# Altium project DIO_SMA.PrjPCB (part 1 of 2)
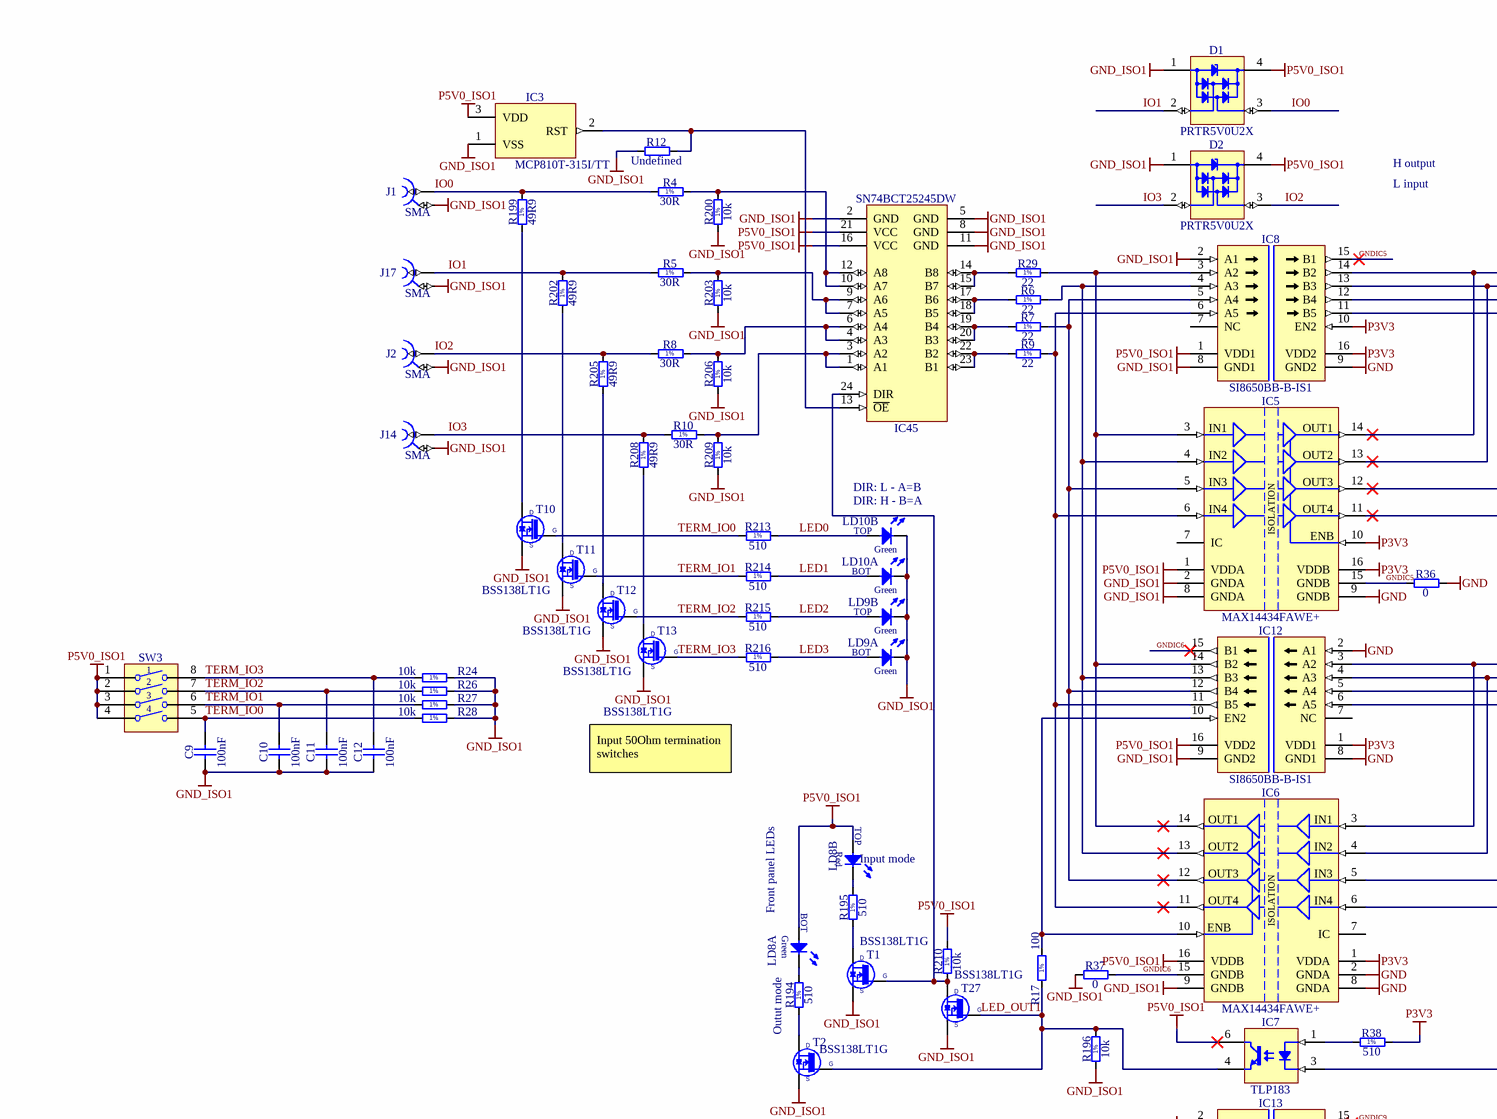
[diagram p0: DIO-SMA.schdoc, top left]
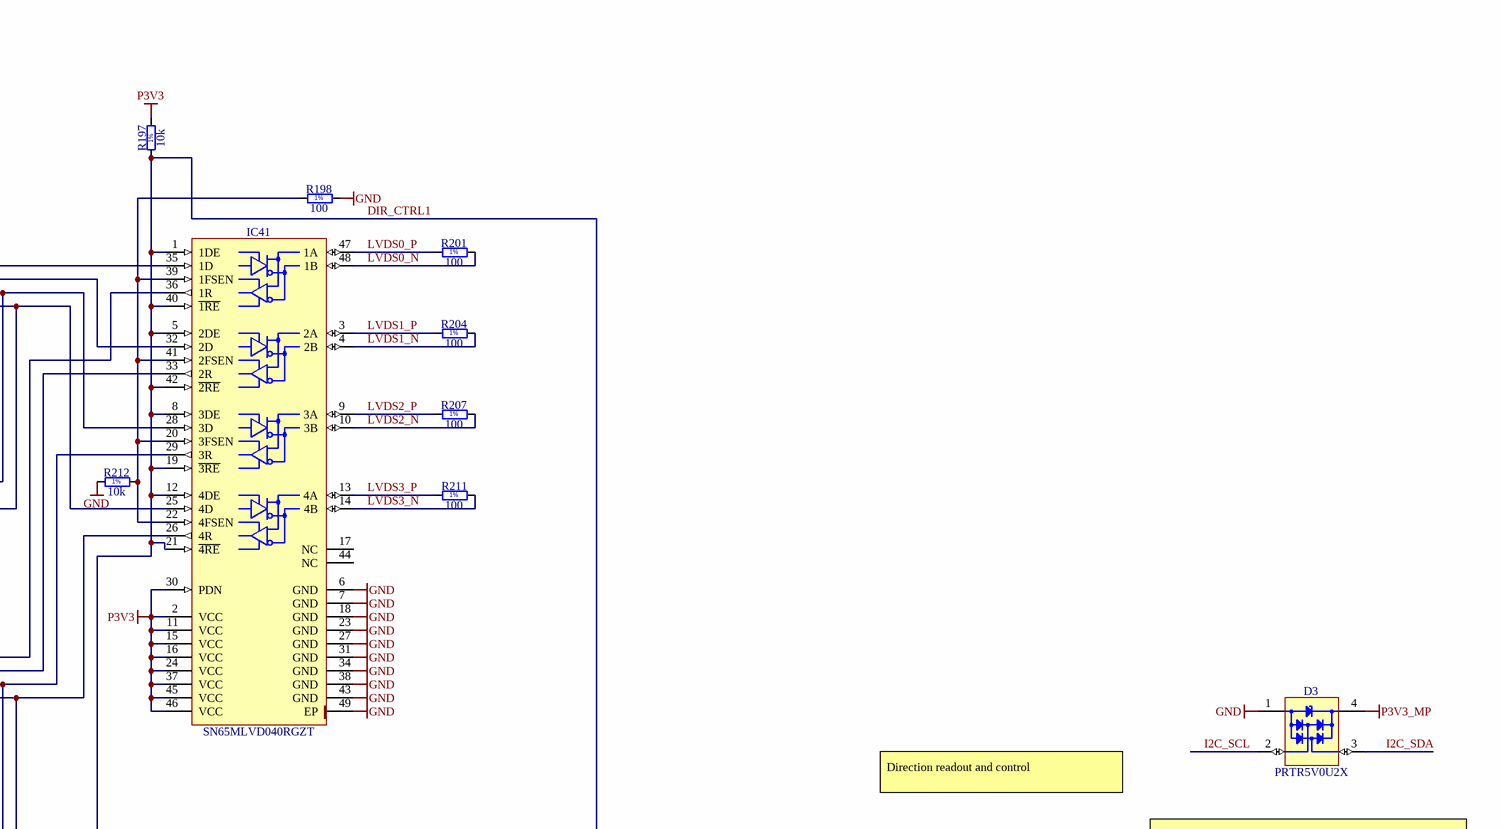
[diagram p1: DIO-SMA.schdoc, top right]
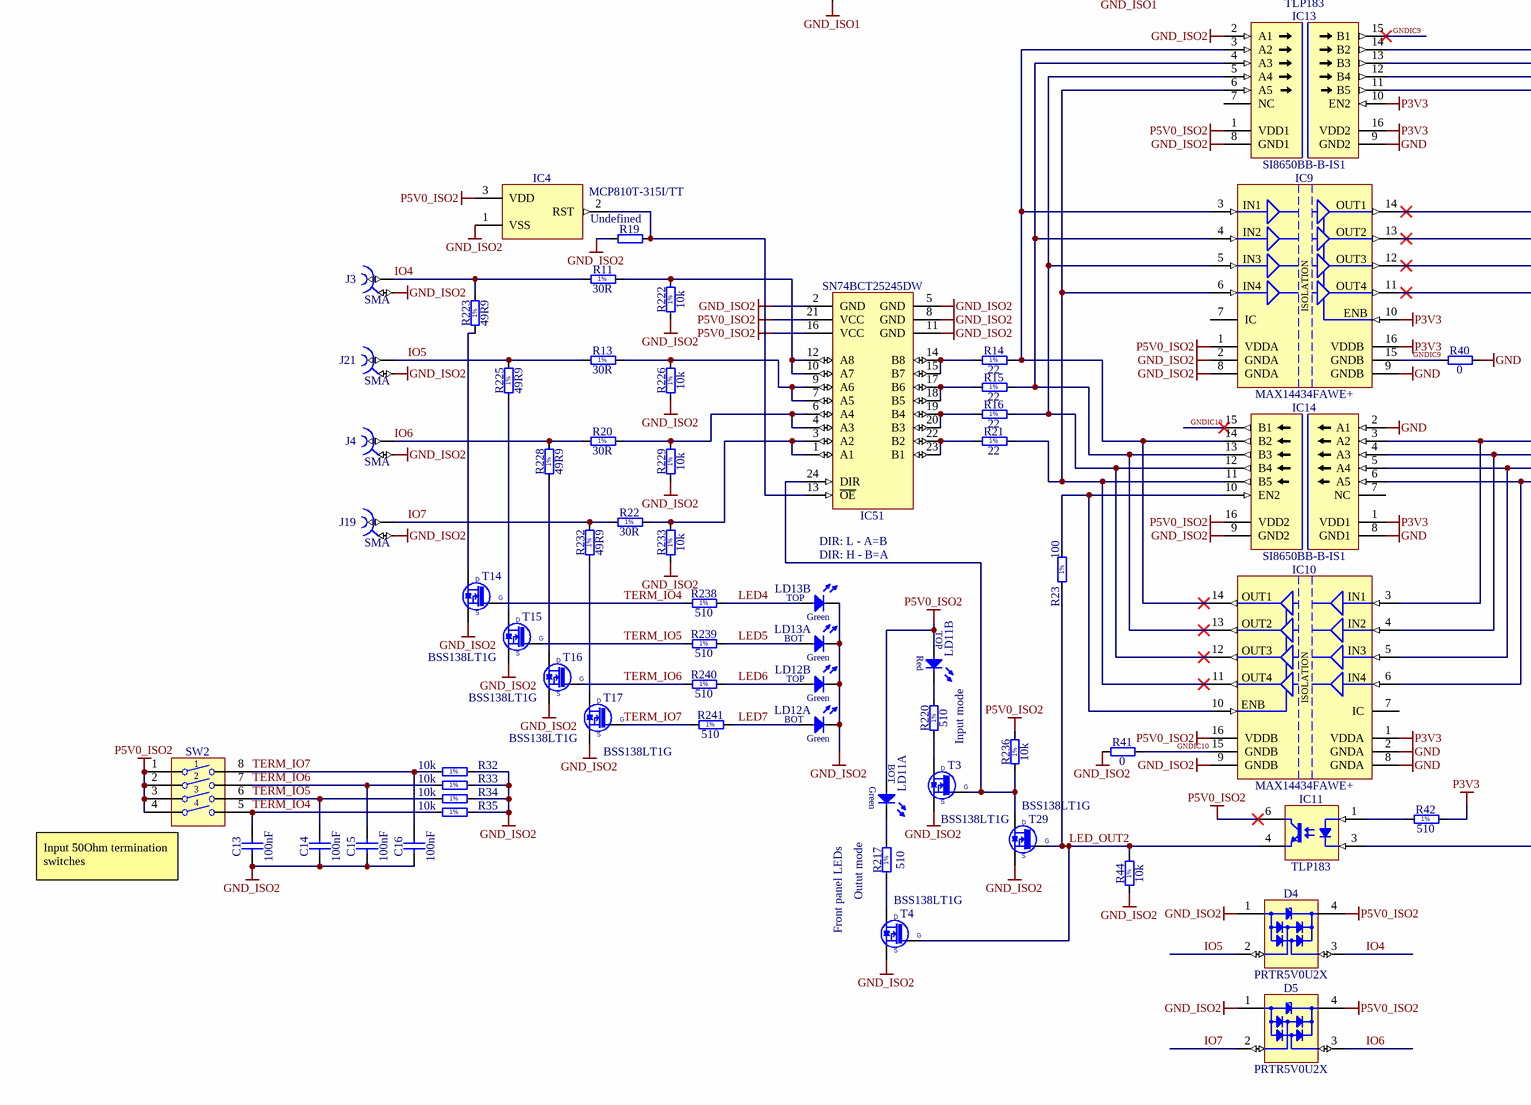
[diagram p2: DIO-SMA.schdoc, bottom left]
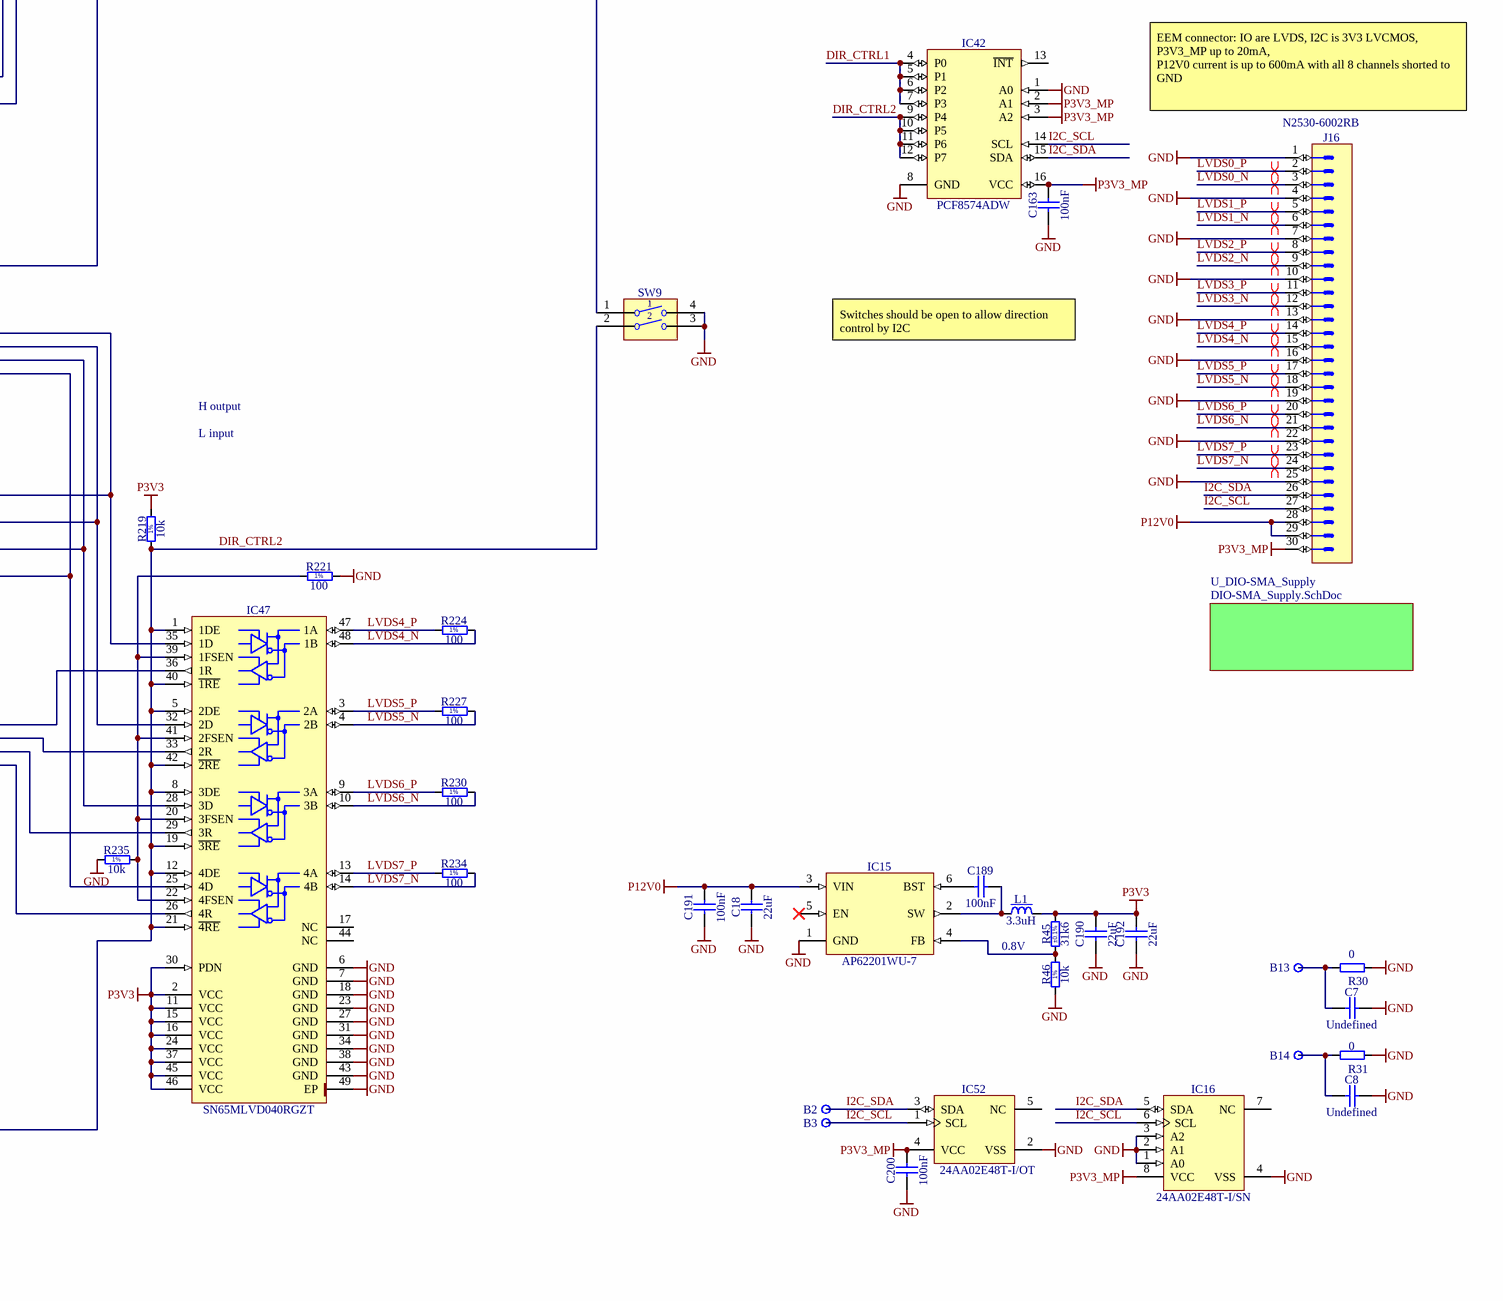
[diagram p3: DIO-SMA.schdoc, bottom right]
P_version: 1.4.3
2 sheets, 236 parts. Net scope: global (net labels, ports and power ports of the same name join across sheets).
Board file: DIO-SMA.PCBDOC
Sheets:
  DIO-SMA.schdoc
    U_DIO-SMA_Supply = DIO-SMA_Supply.SchDoc

## Sheet DIO-SMA.schdoc: DIO-SMA
size 594 x 420 mm; Author: G.K.; CompanyName: WUT; DrawnBy: G.K.; Organization: WUT ISE; Address1: Warsaw Univeristy of Technology; Address2: Nowowiejska 15/19; DocumentNumber: 1; Revision: 1.4.3; SheetNumber: 1; SheetTotal: 2; EDA_Number: ARTIQ; Projet: KASLI 3U subsystem; ModifiedBy: -; CreateDate: XX/XX/XXXX; CheckedDate: -; Title2: v1.4.3; DivGrp: ISE; Designer: G.K.; ModifiedDate: -; ProjectName: KASLI 3U subsystem

### Parts
B2  Plated Hole  [c130h60]  (value not drawn)  (no BOM)
B3  Plated Hole  [c130h60]  (value not drawn)  (no BOM)
B13  Plated Hole  [MTG270_500]  (value not drawn)  (no BOM)
B14  Plated Hole  [MTG270_500]  (value not drawn)  (no BOM)
C7  Undefined  [CAPC2012X135N]
C8  Undefined  [CAPC2012X135N]
C9  100nF  [CAPC1005X55N]
C10  100nF  [CAPC1005X55N]
C11  100nF  [CAPC1005X55N]
C12  100nF  [CAPC1005X55N]
C13  100nF  [CAPC1005X55N]
C14  100nF  [CAPC1005X55N]
C15  100nF  [CAPC1005X55N]
C16  100nF  [CAPC1005X55N]
C18  22uF  [CAPC2012X135N]
C163  100nF  [CAPC1005X55N]
C189  100nF  [CAPC1005X55N]
C190  22uF  [CAPC2012X135N]
C191  100nF  [CAPC1005X55N]
C192  22uF  [CAPC2012X135N]
C200  100nF  [CAPC1005X55N]
D1  PRTR5V0U2X  [SOT190P230X110-4N]
D2  PRTR5V0U2X  [SOT190P230X110-4N]
D3  PRTR5V0U2X  [SOT190P230X110-4N]
D4  PRTR5V0U2X  [SOT190P230X110-4N]
D5  PRTR5V0U2X  [SOT190P230X110-4N]
IC3  MCP810T-315I/TT  [SOT95P237X112-3N]
IC4  MCP810T-315I/TT  [SOT95P237X112-3N]
IC5  MAX14434FAWE+  [SOIC127P1030X265-16N]
IC6  MAX14434FAWE+  [SOIC127P1030X265-16N]
IC7  TLP183  [TOSHIBA_11-4M1S]
IC8  SI8650BB-B-IS1  [SOIC127P600X175-16N]
IC9  MAX14434FAWE+  [SOIC127P1030X265-16N]
IC10  MAX14434FAWE+  [SOIC127P1030X265-16N]
IC11  TLP183  [TOSHIBA_11-4M1S]
IC12  SI8650BB-B-IS1  [SOIC127P600X175-16N]
IC13  SI8650BB-B-IS1  [SOIC127P600X175-16N]
IC14  SI8650BB-B-IS1  [SOIC127P600X175-16N]
IC15  AP62201WU-7  [SOT95P280X100-6N]
IC16  24AA02E48T-I/SN  [SOIC127P600X175-8N]
IC41  SN65MLVD040RGZT  [QFN50P700X700X100-49N-S420]
IC42  PCF8574ADW  [SOIC127P1030X265-16N]
IC45  SN74BCT25245DW  [SOIC127P1030X265-24N]
IC47  SN65MLVD040RGZT  [QFN50P700X700X100-49N-S420]
IC51  SN74BCT25245DW  [SOIC127P1030X265-24N]
IC52  24AA02E48T-I/OT  [SOT95P280X145-5N]
J1  SMA  [DELOCK_65848]
J2  SMA  [DELOCK_65848]
J3  SMA  [DELOCK_65848]
J4  SMA  [DELOCK_65848]
J14  SMA  [MOLEX_73251-2120]
J16  Manufacturer Part Number: N2530-6002RB  [3M_N2530-6002RB]
J17  SMA  [MOLEX_73251-2120]
J19  SMA  [MOLEX_73251-2120]
J21  SMA  [MOLEX_73251-2120]
L1  3.3uH  [IND_WURTH_WE-TPC_4828]
LD8  Red/Green  [LED_DIALIGHT_571-0112F]  (value not drawn)  (parts A,B of 2)
LD9  Green/Green  [LED_DIALIGHT_571-0122F]  (value not drawn)  (parts A,B of 2)
LD10  Green/Green  [LED_DIALIGHT_571-0122F]  (value not drawn)  (parts A,B of 2)
LD11  Red/Green  [LED_DIALIGHT_571-0112F]  (value not drawn)  (parts A,B of 2)
LD12  Green/Green  [LED_DIALIGHT_571-0122F]  (value not drawn)  (parts A,B of 2)
LD13  Green/Green  [LED_DIALIGHT_571-0122F]  (value not drawn)  (parts A,B of 2)
R4  30R  [RESC3225X70N]
R5  30R  [RESC3225X70N]
R6  22  [RESC1005X40N]
R7  22  [RESC1005X40N]
R8  30R  [RESC3225X70N]
R9  22  [RESC1005X40N]
R10  30R  [RESC3225X70N]
R11  30R  [RESC3225X70N]
R12  Undefined  [RESC1005X40N]
R13  30R  [RESC3225X70N]
R14  22  [RESC1005X40N]
R15  22  [RESC1005X40N]
R16  22  [RESC1005X40N]
R17  100  [RESC1005X40N]
R19  Undefined  [RESC1005X40N]
R20  30R  [RESC3225X70N]
R21  22  [RESC1005X40N]
R22  30R  [RESC3225X70N]
R23  100  [RESC1005X40N]
R24  10k  [RESC1005X40N]
R26  10k  [RESC1005X40N]
R27  10k  [RESC1005X40N]
R28  10k  [RESC1005X40N]
R29  22  [RESC1005X40N]
R30  0  [RESC1608X55N]
R31  0  [RESC1608X55N]
R32  10k  [RESC1005X40N]
R33  10k  [RESC1005X40N]
R34  10k  [RESC1005X40N]
R35  10k  [RESC1005X40N]
R36  0  [RESC1005X40N]
R37  0  [RESC1005X40N]
R38  510  [RESC1005X40N]
R40  0  [RESC1005X40N]
R41  0  [RESC1005X40N]
R42  510  [RESC1005X40N]
R44  10k  [RESC1005X40N]
R45  31k6  Tolerance: ±0.1%  [RESC1005X35N]
R46  10k  [RESC1005X40N]
R194  510  [RESC1005X40N]
R195  510  [RESC1005X40N]
R196  10k  [RESC1005X40N]
R197  10k  [RESC1005X40N]
R198  100  [RESC1005X40N]
R199  49R9  [RESC3225X70N]
R200  10k  [RESC1005X40N]
R201  100  [RESC1005X40N]
R202  49R9  [RESC3225X70N]
R203  10k  [RESC1005X40N]
R204  100  [RESC1005X40N]
R205  49R9  [RESC3225X70N]
R206  10k  [RESC1005X40N]
R207  100  [RESC1005X40N]
R208  49R9  [RESC3225X70N]
R209  10k  [RESC1005X40N]
R210  10k  [RESC1005X40N]
R211  100  [RESC1005X40N]
R212  10k  [RESC1005X40N]
R213  510  [RESC1005X40N]
R214  510  [RESC1005X40N]
R215  510  [RESC1005X40N]
R216  510  [RESC1005X40N]
R217  510  [RESC1005X40N]
R219  10k  [RESC1005X40N]
R220  510  [RESC1005X40N]
R221  100  [RESC1005X40N]
R222  10k  [RESC1005X40N]
R223  49R9  [RESC3225X70N]
R224  100  [RESC1005X40N]
R225  49R9  [RESC3225X70N]
R226  10k  [RESC1005X40N]
R227  100  [RESC1005X40N]
R228  49R9  [RESC3225X70N]
R229  10k  [RESC1005X40N]
R230  100  [RESC1005X40N]
R232  49R9  [RESC3225X70N]
R233  10k  [RESC1005X40N]
R234  100  [RESC1005X40N]
R235  10k  [RESC1005X40N]
R236  10k  [RESC1005X40N]
R238  510  [RESC1005X40N]
R239  510  [RESC1005X40N]
R240  510  [RESC1005X40N]
R241  510  [RESC1005X40N]
SW2  Switch  [SW_OMRON_A6S-4102-H]  (value not drawn)
SW3  Switch  [SW_OMRON_A6S-4102-H]  (value not drawn)
SW9  Switch  [SW_OMRON_A6S-2102-H]  (value not drawn)
T1  BSS138LT1G  [SOT95P240X110-3N]
T2  BSS138LT1G  [SOT95P240X110-3N]
T3  BSS138LT1G  [SOT95P240X110-3N]
T4  BSS138LT1G  [SOT95P240X110-3N]
T10  BSS138LT1G  [SOT95P240X110-3N]
T11  BSS138LT1G  [SOT95P240X110-3N]
T12  BSS138LT1G  [SOT95P240X110-3N]
T13  BSS138LT1G  [SOT95P240X110-3N]
T14  BSS138LT1G  [SOT95P240X110-3N]
T15  BSS138LT1G  [SOT95P240X110-3N]
T16  BSS138LT1G  [SOT95P240X110-3N]
T17  BSS138LT1G  [SOT95P240X110-3N]
T27  BSS138LT1G  [SOT95P240X110-3N]
T29  BSS138LT1G  [SOT95P240X110-3N]

### Sub-sheets
U_DIO-SMA_Supply = DIO-SMA_Supply.SchDoc: no entries

### Nets
GND: C7.2 C8.2 C18.1 C163.1 C190.1 C191.1 C192.1 C200.1 D3.1(GND) IC5.9(GNDB) IC6.2(GNDA) IC6.8(GNDA) IC8.9(GND2) IC9.9(GNDB) IC10.2(GNDA) IC10.8(GNDA) IC12.2(A1) IC12.8(GND1) IC13.9(GND2) IC14.2(A1) IC14.8(GND1) IC15.1(GND) IC16.1(A0) IC16.2(A1) IC16.3(A2) IC16.4(VSS) IC41.6(GND) IC41.7(GND) IC41.18(GND) IC41.23(GND) IC41.27(GND) IC41.31(GND) IC41.34(GND) IC41.38(GND) IC41.43(GND) IC41.49(EP) IC42.1(A0) IC42.8(GND) IC47.6(GND) IC47.7(GND) IC47.18(GND) IC47.23(GND) IC47.27(GND) IC47.31(GND) IC47.34(GND) IC47.38(GND) IC47.43(GND) IC47.49(EP) IC52.2(VSS) J16.1 J16.4 J16.7 J16.10 J16.13 J16.16 J16.19 J16.22 J16.25 R30.1 R31.1 R36.2 R40.2 R46.1 R198.2 R212.2 R221.2 R235.2 SW9.3 SW9.4
GND_ISO1: C9.1 C10.1 C11.1 C12.1 D1.1(GND) D2.1(GND) IC3.1(VSS) IC5.2(GNDA) IC5.8(GNDA) IC6.9(GNDB) IC8.2(A1) IC8.8(GND1) IC12.9(GND2) IC45.2(GND) IC45.5(GND) IC45.8(GND) IC45.11(GND) J1.2 J2.2 J14.2 J17.2 LD9.1(C) LD9.3(C) LD10.1(C) LD10.3(C) R12.1 R24.2 R26.2 R27.2 R28.2 R37.1 R196.1 R200.1 R203.1 R206.1 R209.1 T1.2(S) T2.2(S) T10.2(S) T11.2(S) T12.2(S) T13.2(S) T27.2(S)
GND_ISO2: C13.1 C14.1 C15.1 C16.1 D4.1(GND) D5.1(GND) IC4.1(VSS) IC9.2(GNDA) IC9.8(GNDA) IC10.9(GNDB) IC13.2(A1) IC13.8(GND1) IC14.9(GND2) IC51.2(GND) IC51.5(GND) IC51.8(GND) IC51.11(GND) J3.2 J4.2 J19.2 J21.2 LD12.1(C) LD12.3(C) LD13.1(C) LD13.3(C) R19.1 R32.2 R33.2 R34.2 R35.2 R41.1 R44.1 R222.1 R226.1 R229.1 R233.1 T3.2(S) T4.2(S) T14.2(S) T15.2(S) T16.2(S) T17.2(S) T29.2(S)
P3V3: C190.2 C192.2 IC5.10(ENB) IC5.16(VDDB) IC6.1(VDDA) IC8.10(EN2) IC8.16(VDD2) IC9.10(ENB) IC9.16(VDDB) IC10.1(VDDA) IC12.1(VDD1) IC13.10(EN2) IC13.16(VDD2) IC14.1(VDD1) IC41.2(VCC) IC41.11(VCC) IC41.15(VCC) IC41.16(VCC) IC41.24(VCC) IC41.30(PDN) IC41.37(VCC) IC41.45(VCC) IC41.46(VCC) IC47.2(VCC) IC47.11(VCC) IC47.15(VCC) IC47.16(VCC) IC47.24(VCC) IC47.30(PDN) IC47.37(VCC) IC47.45(VCC) IC47.46(VCC) L1.2 R38.2 R42.2 R45.2 R197.2 R219.2
P3V3_MP: C163.2 C200.2 D3.4(VCC) IC16.8(VCC) IC42.2(A1) IC42.3(A2) IC42.16(VCC) IC52.4(VCC) J16.30
P5V0_ISO1: D1.4(VCC) D2.4(VCC) IC3.3(VDD) IC5.1(VDDA) IC6.16(VDDB) IC7.6(C) IC8.1(VDD1) IC12.16(VDD2) IC45.16(VCC) IC45.21(VCC) LD8.2(A) LD8.4(A) R210.2 SW3.1 SW3.2 SW3.3 SW3.4
P5V0_ISO2: D4.4(VCC) D5.4(VCC) IC4.3(VDD) IC9.1(VDDA) IC10.16(VDDB) IC11.6(C) IC13.1(VDD1) IC14.16(VDD2) IC51.16(VCC) IC51.21(VCC) LD11.2(A) LD11.4(A) R236.2 SW2.1 SW2.2 SW2.3 SW2.4
P12V0: C18.2 C191.2 IC15.3(VIN) J16.28 J16.29
DIR_CTRL1: IC7.3(C) IC41.1(1DE) IC41.5(2DE) IC41.8(3DE) IC41.12(4DE) IC41.19(~{3RE}) IC41.21(~{4RE}) IC41.40(~{1RE}) IC41.42(~{2RE}) IC42.4(P0) IC42.5(P1) IC42.6(P2) IC42.7(P3) R197.1 SW9.1
DIR_CTRL2: IC11.3(C) IC42.9(P4) IC42.10(P5) IC42.11(P6) IC42.12(P7) IC47.1(1DE) IC47.5(2DE) IC47.8(3DE) IC47.12(4DE) IC47.19(~{3RE}) IC47.21(~{4RE}) IC47.40(~{1RE}) IC47.42(~{2RE}) R219.1 SW9.2
GNDIC5: IC5.15(GNDB) IC8.15(B1) R36.1
GNDIC6: IC6.15(GNDB) IC12.15(B1) R37.2
GNDIC9: IC9.15(GNDB) IC13.15(B1) R40.1
GNDIC10: IC10.15(GNDB) IC14.15(B1) R41.2
I2C_SCL: B3.1 D3.2(I/O1) IC16.6(SCL) IC42.14(SCL) IC52.1(SCL) J16.27
I2C_SDA: B2.1 D3.3(I/O2) IC16.5(SDA) IC42.15(SDA) IC52.3(SDA) J16.26
IO0: D1.3(I/O2) J1.1 R4.1 R199.2
IO1: D1.2(I/O1) J17.1 R5.1 R202.2
IO2: D2.3(I/O2) J2.1 R8.1 R205.2
IO3: D2.2(I/O1) J14.1 R10.1 R208.2
IO4: D4.3(I/O2) J3.1 R11.1 R223.2
IO5: D4.2(I/O1) J21.1 R13.1 R225.2
IO6: D5.3(I/O2) J4.1 R20.1 R228.2
IO7: D5.2(I/O1) J19.1 R22.1 R232.2
LED0: LD10.4(A) R213.2
LED1: LD10.2(A) R214.2
LED2: LD9.4(A) R215.2
LED3: LD9.2(A) R216.2
LED4: LD13.4(A) R238.2
LED5: LD13.2(A) R239.2
LED6: LD12.4(A) R240.2
LED7: LD12.2(A) R241.2
LED_OUT1: IC7.4(E) R17.1 R196.2 T2.1(G) T27.1(G)
LED_OUT2: IC11.4(E) R23.1 R44.2 T4.1(G) T29.1(G)
LVDS0_N: IC41.48(1B) J16.3 R201.2
LVDS0_P: IC41.47(1A) J16.2 R201.1
LVDS1_N: IC41.4(2B) J16.6 R204.2
LVDS1_P: IC41.3(2A) J16.5 R204.1
LVDS2_N: IC41.10(3B) J16.9 R207.2
LVDS2_P: IC41.9(3A) J16.8 R207.1
LVDS3_N: IC41.14(4B) J16.12 R211.2
LVDS3_P: IC41.13(4A) J16.11 R211.1
LVDS4_N: IC47.48(1B) J16.15 R224.2
LVDS4_P: IC47.47(1A) J16.14 R224.1
LVDS5_N: IC47.4(2B) J16.18 R227.2
LVDS5_P: IC47.3(2A) J16.17 R227.1
LVDS6_N: IC47.10(3B) J16.21 R230.2
LVDS6_P: IC47.9(3A) J16.20 R230.1
LVDS7_N: IC47.14(4B) J16.24 R234.2
LVDS7_P: IC47.13(4A) J16.23 R234.1
TERM_IO0: C9.2 R28.1 R213.1 SW3.5 T10.1(G)
TERM_IO1: C10.2 R27.1 R214.1 SW3.6 T11.1(G)
TERM_IO2: C11.2 R26.1 R215.1 SW3.7 T12.1(G)
TERM_IO3: C12.2 R24.1 R216.1 SW3.8 T13.1(G)
TERM_IO4: C13.2 R35.1 R238.1 SW2.5 T14.1(G)
TERM_IO5: C14.2 R34.1 R239.1 SW2.6 T15.1(G)
TERM_IO6: C15.2 R33.1 R240.1 SW2.7 T16.1(G)
TERM_IO7: C16.2 R32.1 R241.1 SW2.8 T17.1(G)
NetB13_1: B13.1 C7.1 R30.2
NetB14_1: B14.1 C8.1 R31.2
NetC189_1: C189.1 IC15.6(BST)
NetC189_2: C189.2 IC15.2(SW) L1.1
NetIC3_2: IC3.2(RST) IC45.13(~{OE}) R12.2
NetIC4_2: IC4.2(RST) IC51.13(~{OE}) R19.2
NetIC5_3: IC5.3(IN1) IC6.14(OUT1) IC8.3(A2) IC12.14(B2) R29.2
NetIC5_4: IC5.4(IN2) IC6.13(OUT2) IC8.4(A3) IC12.13(B3) R6.2
NetIC5_5: IC5.5(IN3) IC6.12(OUT3) IC8.5(A4) IC12.12(B4) R7.2
NetIC5_6: IC5.6(IN4) IC6.11(OUT4) IC8.6(A5) IC12.11(B5) R9.2
NetIC5_11: IC5.11(OUT4) IC8.11(B5) IC41.25(4D)
NetIC5_12: IC5.12(OUT3) IC8.12(B4) IC41.28(3D)
NetIC5_13: IC5.13(OUT2) IC8.13(B3) IC41.32(2D)
NetIC5_14: IC5.14(OUT1) IC8.14(B2) IC41.35(1D)
NetIC6_3: IC6.3(IN1) IC12.3(A2) IC41.36(1R)
NetIC6_4: IC6.4(IN2) IC12.4(A3) IC41.33(2R)
NetIC6_5: IC6.5(IN3) IC12.5(A4) IC41.29(3R)
NetIC6_6: IC6.6(IN4) IC12.6(A5) IC41.26(4R)
NetIC6_10: IC6.10(ENB) IC12.10(EN2) R17.2
NetIC7_1: IC7.1(A) R38.1
NetIC9_3: IC9.3(IN1) IC10.14(OUT1) IC13.3(A2) IC14.14(B2) R14.2
NetIC9_4: IC9.4(IN2) IC10.13(OUT2) IC13.4(A3) IC14.13(B3) R15.2
NetIC9_5: IC9.5(IN3) IC10.12(OUT3) IC13.5(A4) IC14.12(B4) R16.2
NetIC9_6: IC9.6(IN4) IC10.11(OUT4) IC13.6(A5) IC14.11(B5) R21.2
NetIC9_11: IC9.11(OUT4) IC13.11(B5) IC47.25(4D)
NetIC9_12: IC9.12(OUT3) IC13.12(B4) IC47.28(3D)
NetIC9_13: IC9.13(OUT2) IC13.13(B3) IC47.32(2D)
NetIC9_14: IC9.14(OUT1) IC13.14(B2) IC47.35(1D)
NetIC10_3: IC10.3(IN1) IC14.3(A2) IC47.36(1R)
NetIC10_4: IC10.4(IN2) IC14.4(A3) IC47.33(2R)
NetIC10_5: IC10.5(IN3) IC14.5(A4) IC47.29(3R)
NetIC10_6: IC10.6(IN4) IC14.6(A5) IC47.26(4R)
NetIC10_10: IC10.10(ENB) IC14.10(EN2) R23.2
NetIC11_1: IC11.1(A) R42.1
NetIC15_4: IC15.4(FB) R45.1 R46.2
NetIC41_20: IC41.20(3FSEN) IC41.22(4FSEN) IC41.39(1FSEN) IC41.41(2FSEN) R198.1 R212.1
NetIC45_1: IC45.1(A1) IC45.3(A2) R10.2 R209.2
NetIC45_4: IC45.4(A3) IC45.6(A4) R8.2 R206.2
NetIC45_7: IC45.7(A5) IC45.9(A6) R5.2 R203.2
NetIC45_10: IC45.10(A7) IC45.12(A8) R4.2 R200.2
NetIC45_14: IC45.14(B8) IC45.15(B7) R29.1
NetIC45_17: IC45.17(B6) IC45.18(B5) R6.1
NetIC45_19: IC45.19(B4) IC45.20(B3) R7.1
NetIC45_22: IC45.22(B2) IC45.23(B1) R9.1
NetIC45_24: IC45.24(DIR) R210.1 T1.1(G) T27.3(D)
NetIC47_20: IC47.20(3FSEN) IC47.22(4FSEN) IC47.39(1FSEN) IC47.41(2FSEN) R221.1 R235.1
NetIC51_1: IC51.1(A1) IC51.3(A2) R22.2 R233.2
NetIC51_4: IC51.4(A3) IC51.6(A4) R20.2 R229.2
NetIC51_7: IC51.7(A5) IC51.9(A6) R13.2 R226.2
NetIC51_10: IC51.10(A7) IC51.12(A8) R11.2 R222.2
NetIC51_14: IC51.14(B8) IC51.15(B7) R14.1
NetIC51_17: IC51.17(B6) IC51.18(B5) R15.1
NetIC51_19: IC51.19(B4) IC51.20(B3) R16.1
NetIC51_22: IC51.22(B2) IC51.23(B1) R21.1
NetIC51_24: IC51.24(DIR) R236.1 T3.1(G) T29.3(D)
NetLD8_1: LD8.1(C) R194.2
NetLD8_3: LD8.3(C) R195.2
NetLD11_1: LD11.1(C) R217.2
NetLD11_3: LD11.3(C) R220.2
NetR194_1: R194.1 T2.3(D)
NetR195_1: R195.1 T1.3(D)
NetR199_1: R199.1 T10.3(D)
NetR202_1: R202.1 T11.3(D)
NetR205_1: R205.1 T12.3(D)
NetR208_1: R208.1 T13.3(D)
NetR217_1: R217.1 T4.3(D)
NetR220_1: R220.1 T3.3(D)
NetR223_1: R223.1 T14.3(D)
NetR225_1: R225.1 T15.3(D)
NetR228_1: R228.1 T16.3(D)
NetR232_1: R232.1 T17.3(D)

Not connected (* = marked no-connect by the designer): IC5 7(IC); IC6 7(IC); IC8 7(NC); IC9 7(IC); IC10 7(IC); IC12 7(NC); IC13 7(NC); IC14 7(NC); IC15 5(EN)*; IC16 7(NC); IC41 17(NC) 44(NC); IC42 13(~{INT}); IC47 17(NC) 44(NC); IC52 5(NC)

### Layout directives
differential pair: LVDS0_N, LVDS0_P, LVDS1_N, LVDS1_P, LVDS2_N, LVDS2_P, LVDS3_N, LVDS3_P, LVDS4_N, LVDS4_P, LVDS5_N, LVDS5_P, LVDS6_N, LVDS6_P, LVDS7_N, LVDS7_P

### Notes on the sheet
- H output
- L input
- (near LD10) DIR: L - A=B
- (near LD10) DIR: H - B=A
- Input 50Ohm termination switches
- Direction readout and control
- (near LD8) Input mode
- (near LD8) Front panel LEDs
- EEM connector: IO are LVDS, I2C is 3V3 LVCMOS, P3V3_MP up to 20mA,
  P12V0 current is up to 600mA with all 8 channels shorted to GND
- Outut mode
- Switches should be open to allow direction control by I2C
- DIR: L - A=B
- DIR: H - B=A
- 0.8V
- Input mode
- (near SW2) Input 50Ohm termination switches
- Front panel LEDs
- Project/Equipment
- Document
- File
- Designer
- Drawn by
- Check.by
- Last Mod.
- Copyright WUT ISE 2020.
  This documentation describes Open Hardware and is licensed under the CERN OHL v.1.2. You may redistribute and modify this documentation under the terms of the CERN OHL v.1.2. (http://ohwr.org/CERNOHL). This documentation is distributed WITHOUT ANY EXPRESS OR IMPLIED WARRANTY, INCLUDING OF MERCHANTABILITY, SATISFACTORY QUALITY AND FITNESS FOR A PARTICULAR PURPOSE. Please see the CERN OHL v.1.2 for applicable conditions.
- Contact
- Print Date
- Sheet
- Size
- A2
- of
- Rev
- (in symbol LED_DIALIGHT_571-0112F, part A) BOT; Green
- (in symbol LED_DIALIGHT_571-0112F, part B) TOP; Red
- (in symbol LED_DIALIGHT_571-0122F, part A) BOT; Green
- (in symbol LED_DIALIGHT_571-0122F, part B) TOP; Green
- (in symbol MAX14434FAWE+) ISOLATION
- (in symbol R0402_10K_1%_0.0625W_100PPM) 1%
- (in symbol R0402_22R_1%_0.0625W_100PPM) 1%
- (in symbol R0402_100R_1%_0.1W_100PPM) 1%
- (in symbol R0402_510R_1%_0.0625W_100PPM) 1%
- (in symbol R1210_30R_5%_0.5W_200PPM) 1%
- (in symbol R1210_49R9_1%_0.5W_100PPM_VISHAY_CRCW) 1%

### Library data of the parts
B2 B3 = PLATED_HOLE0.6_PAD1.3: Single Terminal Socket; Part Description: Plated Through Hole: Hole Dia.=0.6mm Pad Dia.=1.3mm; Mounted: No; Part Number: PLATED_HOLE0.6_PAD1.3; Component Type: Standard (No BOM); Pin Count: 1; Family: Plated Hole; Socket: No; SMD: No; Sense: No; Status: None; ComponentHeight: 0mm; HelpURL: Undefined; Author: CERN DEM MR; CreateDate: 02.03.2016; LatestRevisionDate: 02.03.2016; PackageDescription: Plated Through Hole: Hole Dia.=0.6mm Pad Dia.=1.3mm
B13 B14 = PLATED_HOLE2.7_PAD5.0: Single Terminal Socket; Part Description: Plated Through Hole: Hole Dia.=2.7mm Pad Dia.=5.0mm; Mounted: No; Part Number: PLATED_HOLE2.7_PAD5.0; Component Type: Standard (No BOM); Pin Count: 1; Family: Plated Hole; Socket: No; SMD: No; Sense: No; Status: None; ComponentHeight: 0mm; HelpURL: Undefined; Author: CERN DEM JMW; CreateDate: 27.09.2011; LatestRevisionDate: 27.09.2011; PackageDescription: Plated Through Hole: Hole Dia.=2.7mm Pad Dia.=5.0mm
C7 C8 = CC0805_NO-VALUE: Non-polarised capacitor; Part Description: Reserved Footprint For 0805(2012) Chip Ceramic Capacitor; Mounted: No; Part Number: CC0805_NO-VALUE; Component Kind: Standard; Component Type: Standard; Pin Count: 2; Value: Undefined; Status: None; Manufacturer: Undefined; Manufacturer Part Number: CC0805_NO-VALUE; Case: 0805; Socket: No; SMD: Yes; Sense: No; Manufacturer1 ComponentHeight: 1.35mm; HelpURL: Undefined; Author: CERN DEM JLC; CreateDate: 10.12.2008; LatestRevisionDate: 11.09.2013
C9-C16 C163 C189 C191 C200 = CC0402_100NF_16V_10%_X5R: Non-polarised capacitor; Part Description: SMD Multilayer Chip Ceramic Capacitor; Manufacturer: GENERIC; Manufacturer1 Part Number: GRM155R61C104KA88D; Voltage: 16V; TC: X5R; Tolerance: ±10%; Part Number: CC0402_100NF_16V_10%_X5R; Component Kind: Standard; Component Type: Standard; Pin Count: 2; Value: 100nF; Status: None; Manufacturer Part Number: CC0402_100NF_16V_10%_X5R; Case: 0402; Mounted: Yes; Socket: No; SMD: Yes; Sense: No; Manufacturer1 Example: MURATA; Manufacturer1 ComponentHeight: 0.55mm; HelpURL: \\cern.ch\dfs\Applications\Altium\Datasheets\CC0402_X5R_MURATA_GRM.pdf; Author: CERN DEM JLC; CreateDate: 10.12.2013; LatestRevisionDate: 10.12.2013
C18 C190 C192 = CC0805_22UF_16V_10%_X5R: Non-polarised capacitor; Part Description: SMD Multilayer Chip Ceramic Capacitor; Manufacturer: GENERIC; Manufacturer1 Part Number: C2012X5R1C226KT; Voltage: 16V; TC: X5R; Tolerance: ±10%; Part Number: CC0805_22UF_16V_10%_X5R; Component Kind: Standard; Component Type: Standard; Pin Count: 2; Value: 22uF; Status: Preferred; Manufacturer Part Number: CC0805_22UF_16V_10%_X5R; Case: 0805; Mounted: Yes; Socket: No; SMD: Yes; Sense: No; Manufacturer1 Example: TDK; Manufacturer1 ComponentHeight: 1.35mm; HelpURL: \\cern.ch\dfs\Applications\Altium\Datasheets\CC0805_X5R_TDK_C.pdf; Author: CERN DEM JLC; CreateDate: 25.10.2012; LatestRevisionDate: 25.10.2012
D1-D5 = PRTR5V0U2X: Ultra Low Capacitance Double Rail-to-Rail ESD Protection Diode; Part Description: Ultra Low Capacitance (1pF) Double Rail-to-Rail ESD Protection Diode (8kV); Manufacturer: NXP SEMICONDUCTORS; Voltage: 5.5V; PressFit: No; Bonding: No; Part Number: PRTR5V0U2X; Component Kind: Standard; Component Type: Standard; Device: PRTR5V0U2X; PackageDescription: SOT143B, SOT, 1.90mm Pitch; 4 Pin, 1.30mm W X 2.90mm L X 1.10mm H body, IPC Medium Density; Manufacturer Part Number: PRTR5V0U2X; Pin Count: 4; Case: SOT143B; Mounted: Yes; Socket: No; SMD: Yes; Sense: No; ComponentHeight: 1.1mm; HelpURL: \\cern.ch\dfs\Applications\Altium\Datasheets\PRTR5V0U2X.pdf; Author: CERN DEM JLC; CreateDate: 22.03.2011; LatestRevisionDate: 22.03.2011
IC3 IC4 = VMON_MCP810: 3.075V Microcontroller Supervisory Circuit With Push-Pull Output; Manufacturer: MICROCHIP TECHNOLOGY; PressFit: No; Bonding: No; Part Number: MCP810T-315I/TT; Component Kind: Standard; Component Type: Standard; Device: MCP810T-315I/TT; PackageDescription: SOT, 0.95mm, pitch; 3 pin,1.30mm W X 2.92mm L X 1.12mm H body, IPC Medium Density; Part Description: 3.075V Microcontroller Supervisory Circuit With Push-Pull Output; Manufacturer Part Number: MCP810T-315I/TT; Pin Count: 3; Case: SOT23; Mounted: Yes; Socket: No; SMD: Yes; Sense: No; ComponentHeight: 1.12mm; Author: GK; HelpURL: \\cern.ch\dfs\Applications\Altium\Datasheets\MCP809T-315I-TT.pdf; CreateDate: 16.06.2011; LatestRevisionDate: 16.06.2011
IC5 IC6 IC9 IC10 = MAX14434FAWE+: Four-Channel, Fast, Low-Power, 5kVRMS Digital Isolators; Part Description: Four-Channel, Fast, Low-Power, 5kVRMS Digital Isolators, Data Rate 200 Mbps, Default Output Low; Manufacturer: MAXIM; PressFit: No; Bonding: No; Part Number: MAX14434FAWE+; Component Kind: Standard; Component Type: Standard; Device: MAX14434FAWE+; PackageDescription: SOIC, 1.27mm Pitch; 16 Pin, 7.50mm W X 10.3mm L X 2.65mm H body, IPC Medium Density; Manufacturer Part Number: MAX14434FAWE+; Pin Count: 16; Case: SOIC16W; Mounted: Yes; Socket: No; SMD: Yes; Sense: No; ComponentHeight: 2.65mm; Author: CERN DEM HF; HelpURL: \\cern.ch\dfs\Applications\Altium\Datasheets\MAX14434.pdf; CreateDate: 29.11.2021; LatestRevisionDate: 29.11.2021
IC7 IC11 = TLP183: Single Optocoupler; Part Description: Photocoupler InGaAs Infrared LED & Photo-Transistor; Manufacturer: TOSHIBA; PressFit: No; Bonding: No; Part Number: TLP183; Component Kind: Standard; Component Type: Standard; Device: TLP183; PackageDescription: SOIC, 1.27mm Pitch; 4 Pin, TOSHIBA Case (5mm Creepage); Manufacturer Part Number: TLP183; Pin Count: 4; Case: SOIC4; Mounted: Yes; Socket: No; SMD: Yes; Sense: No; ComponentHeight: 2.3mm; HelpURL: \\cern.ch\dfs\Applications\Altium\Datasheets\TLP183.pdf; Author: CERN DEM JMW; CreateDate: 05.10.2015; LatestRevisionDate: 04.09.2017
IC8 IC12-IC14 = SI8650BB-B-IS1: Low Power Five-Channel Digital Isolator; Part Description: 2.5kV 150Mbps Low Power Five-Channel Digital Isolator; Manufacturer: SKYWORKS; Manufacturer Part Number: SI8651BB-B-IS1; PressFit: No; Bonding: No; Part Number: SI8650BB-B-IS1; Component Kind: Standard; Component Type: Standard; Device: SI8650BB-B-IS1; PackageDescription: SOIC 16, Pitch 1.27mm - Body 4x10mm, IPC Medium Density; Pin Count: 16; Case: SOIC16; Mounted: Yes; Socket: No; SMD: Yes; Sense: No; ComponentHeight: 1.75mm; Author: CERN DEM HF; HelpURL: \\cern.ch\dfs\Applications\Altium\Datasheets\SI8650BB-B-IS1.pdf; CreateDate: 14.10.2021; LatestRevisionDate: 14.10.2021
IC15 = AP62201WU-7: 4.2V TO 18V INPUT, 2A LOW IQ SYNCHRONOUS BUCK CONVERTER; Manufacturer: DIODES INCORPORATED; PressFit: No; Bonding: No; Part Number: AP62201WU-7; Component Kind: Standard; Component Type: Standard; Device: AP62201WU-7; PackageDescription: SOT23, 0.95mm Pitch; 6 Pin, 1.625mm W X 2.90mm L X 1.00mm H body, IPC Medium Density; Part Description: 4.2V TO 18V INPUT, 2A LOW IQ SYNCHRONOUS BUCK CONVERTER; Manufacturer Part Number: AP62201WU-7; Pin Count: 6; Case: SOT23-6; Mounted: Yes; Socket: No; SMD: Yes; Sense: No; ComponentHeight: 1.1mm; HelpURL: \\cern.ch\dfs\Applications\Altium\Datasheets\AP6220x.pdf; Author: CERN DEM HF; CreateDate: 07.01.2022; LatestRevisionDate: 07.01.2022
IC16 = MEM_24AA02E48T-I/SN: 1.7V-5.5V, 2K I2C™ Serial EEPROMs with EUI-48™ Node Identity; Manufacturer: MICROCHIP TECHNOLOGY; PressFit: No; Bonding: No; Part Number: 24AA02E48T-I/SN; Component Kind: Standard; Component Type: Standard; Device: 24AA02E48T-I/SN; PackageDescription: SOIC 8, Pitch 1.27mm - Body 4x5mm, IPC Medium Density; Part Description: 1.7V-5.5V, 2K I2C™ Serial EEPROMs with EUI-48™ Node Identity; Manufacturer Part Number: 24AA02E48T-I/SN; Pin Count: 8; Case: SOIC8; Mounted: Yes; Socket: No; SMD: Yes; Sense: No; ComponentHeight: 1.75mm; HelpURL: \\cern.ch\dfs\Applications\Altium\Datasheets\24AA025E48-I-SN.pdf; Author: GK; CreateDate: 19.07.2016; LatestRevisionDate: 19.07.2016
IC41 IC47 = SN65MLVD040RGZT: 4-Channel Half-Duplex M-LVDS Line Transceiver; Manufacturer: TEXAS INSTRUMENTS; PressFit: No; Bonding: No; Part Number: SN65MLVD040RGZT; Component Kind: Standard; Component Type: Standard; Device: SN65MLVD040RGZT; PackageDescription: QFN, 0.50mm Pitch, Square; 48 Pin, 7.00mm L X 7.00mm W X 1mm H body (W/Thermal Tab 4.2mm X 4.2mm), IPC Medium Density; Part Description: 4-Channel Half-Duplex M-LVDS Line Transceiver; Manufacturer Part Number: SN65MLVD040RGZT; Pin Count: 49; Case: QFN48; Mounted: Yes; Socket: No; SMD: Yes; Sense: No; ComponentHeight: 1mm; Author: CERN DEM JLC; HelpURL: \\cern.ch\dfs\Applications\Altium\Datasheets\SN65MLVD040RGZT.pdf; CreateDate: 17.03.2011; LatestRevisionDate: 17.03.2011
IC42 = PCF8574ADW: Remote 8-bit I/O Expander For I2C Bus; Manufacturer: TEXAS INSTRUMENTS; PressFit: No; Bonding: No; Part Number: PCF8574ADW; Component Kind: Standard; Component Type: Standard; Device: PCF8574ADW; PackageDescription: SOIC 16, Pitch 1.27mm - Body 7.5x10.3mm, IPC Medium Density; Part Description: Remote 8-bit I/O Expander For I2C Bus; Manufacturer Part Number: PCF8574ADW; Pin Count: 16; Case: SOIC16W; Mounted: Yes; Socket: No; SMD: Yes; Sense: No; ComponentHeight: 2.65mm; Author: CERN DEM JLC; HelpURL: \\cern.ch\dfs\Applications\Altium\Datasheets\PCF8574ADW.pdf; CreateDate: 01.11.2012; LatestRevisionDate: 01.11.2012
IC45 IC51 = SN74BCT25245DW: 25 Ohms Octal Bus Transceiver With 3-State Outputs; Manufacturer: TEXAS INSTRUMENTS; PressFit: No; Bonding: No; Part Number: SN74BCT25245DW; Component Kind: Standard; Component Type: Standard; Device: SN74BCT25245DW; PackageDescription: SOIC 24, Pitch 1.27mm - Body 7.6x15.6mm, IPC Medium Density; Part Description: 25 Ohms Octal Bus Transceiver With 3-State Outputs; Manufacturer Part Number: SN74BCT25245DW; Pin Count: 24; Case: SOIC24; Mounted: Yes; Socket: No; SMD: Yes; Sense: No; ComponentHeight: 2.65mm; Author: CERN DEM JLC; HelpURL: \\cern.ch\dfs\Applications\Altium\Datasheets\SN74BCT25245DW.pdf; CreateDate: 09.11.2009; LatestRevisionDate: 09.11.2009
IC52 = 24AA02E48T-I/OT: 1.7V-5.5V, 2K I2C Serial EEPROM With EUI-48 Node Identity; Manufacturer: MICROCHIP TECHNOLOGY; PressFit: No; Bonding: No; Part Number: 24AA02E48T-I/OT; Component Kind: Standard; Component Type: Standard; Device: 24AA02E48T-I/OT; PackageDescription: SOT, 0.95mm pitch; 5 pin, 1.60mm W X 2.90mm L X 1.45mm H body, IPC Medium Density; Part Description: 1.7V-5.5V, 2K I2C Serial EEPROM With EUI-48 Node Identity; Manufacturer Part Number: 24AA02E48T-I/OT; Pin Count: 5; Case: SOT23-5; Mounted: Yes; Socket: No; SMD: Yes; Sense: No; ComponentHeight: 1.45mm; HelpURL: \\cern.ch\dfs\Applications\Altium\Datasheets\24AA02E48T-I-OT.pdf; Author: CERN DEM MR; CreateDate: 31.03.2016; LatestRevisionDate: 31.03.2016
J1-J4 = DELOCK_65848: 50 Ohm Through Hole SMA Right Angle PCB Jack; Manufacturer: DELOCK; Manufacturer Part Number: 5848 (4043619658480); PressFit: No; Part Number: DELOCK_65848; Component Kind: Standard; Component Type: Standard; Pin Count: 5; Family: SMA; Mounted: Yes; Socket: No; SMD: No; Sense: No; Status: None; Part Description: 50 Ohm Through Hole SMA Right Angle PCB Jack; ComponentHeight: 12.5; HelpURL: \\cern.ch\dfs\Applications\Altium\Datasheets\AMPHENOL_132203-16.pdf; Author: GK; CreateDate: 13.05.2019; LatestRevisionDate: 13.05.2019
J14 J17 J19 J21 = CON_SMA_RA_SMD_73251-2120: 50 Ohm, SMA Edge Mount PCB, With Jam Nut And Lock Washer; Manufacturer: MOLEX; PressFit: No; Part Number: MOLEX_73251-2120; Component Kind: Standard; Component Type: Standard; Pin Count: 5; Family: SMA; Mounted: Yes; Socket: No; SMD: Yes; Sense: No; Status: None; Part Description: 50 Ohm, SMA Edge Mount PCB, With Jam Nut And Lock Washer; Manufacturer Part Number: 73251-2120; ComponentHeight: 5.75mm; HelpURL: \\cern.ch\dfs\Applications\Altium\Datasheets\MOLEX_73251-2121.pdf; Author: CERN DEM JLC; CreateDate: 26.10.2016; LatestRevisionDate: 26.10.2016
J16 = 3M_N2530-6002RB: Connector 30 Male; Part Description: 30 Contacts - Straight .100'' x .100'' Low Profile Four-Wall Header, 2500 Series; Manufacturer: 3M; PressFit: No; Part Number: 3M_N2530-6002RB; Component Kind: Standard; Component Type: Standard; Pin Count: 30; Family: Header 30; Mounted: Yes; Socket: No; SMD: No; Sense: No; Status: None; ComponentHeight: 10.03mm; HelpURL: \\cern.ch\dfs\Applications\Altium\Datasheets\3M_N2530-6002RB.pdf; Author: CERN DEM JLC; CreateDate: 11.02.2009; LatestRevisionDate: 11.08.2009
L1 = IND_3.3UH_30%_WURTH_WE-TPC_744043003: Inductor With Core; Part Description: Shielded Tiny Power Inductor (WE-TPC Serie); Manufacturer: WURTH ELEKTRONIK; Power: 2.15A; Resistance: 0.03R; Tolerance: ±30%; Part Number: IND_3.3UH_30%_WURTH_WE-TPC_744043003; Component Kind: Standard; Component Type: Standard; Pin Count: 2; Value: 3.3uH; Manufacturer Part Number: 744043003; Mounted: Yes; Socket: No; SMD: Yes; Sense: No; ComponentHeight: 3mm; HelpURL: \\cern.ch\dfs\Applications\Altium\Datasheets\IND_WURTH_WE-TPC_744043003.pdf; Author: CERN DEM JLC; CreateDate: 12.07.2011; LatestRevisionDate: 24.01.2012
LD8 LD11 = LED_DIALIGHT_571-0112F: 2x LED  Botom Green, Top Red; Part Description: Dual 2mm  LEDs, Red Top,Green Bot, CBI® Circuit Board Indicator (Without positioning pins); PressFit: No; Bonding: No; Part Number: LED_DIALIGHT_571-0112F; Component Kind: Standard; Component Type: Standard; Color: Red/Green; PackageDescription: 2x 2mm LED (Top: Red, Bot: Green) PCB Edge Mounting (Without positioning pins) DIALIGHT 571 Serie; Manufacturer: DIALIGHT; Manufacturer Part Number: 571-0112F; Pin Count: 4; Mounted: Yes; Socket: No; SMD: No; Sense: No; ComponentHeight: 8.6mm; HelpURL: \\cern.ch\dfs\Applications\Altium\Datasheets\LED_DIALIGHT_571-0112F.pdf; Author: CERN DEM JLC; CreateDate: 09.11.2009; LatestRevisionDate: 17.03.2010
LD9 LD10 LD12 LD13 = LED_DIALIGHT_571-0122F: LED x2 Green 1C2A-BOT_3C4A-TOP; Part Description: Dual 2mm Green LEDs CBI® Circuit Board Indicator (Without positioning pins); PressFit: No; Bonding: No; Part Number: LED_DIALIGHT_571-0122F; Component Kind: Standard; Component Type: Standard; Color: Green/Green; PackageDescription: 2x 2mm Red LED PCB Edge Mounting (Without positioning pins) DIALIGHT 571 Serie; Manufacturer: DIALIGHT; Manufacturer Part Number: 571-0122F; Pin Count: 4; Mounted: Yes; Socket: No; SMD: No; Sense: No; ComponentHeight: 8.6mm; HelpURL: \\cern.ch\dfs\Applications\Altium\Datasheets\LED_DIALIGHT_571-0122F.pdf; Author: CERN DEM JLC; CreateDate: 09.11.2009; LatestRevisionDate: 17.03.2010
R4 R5 R8 R10 R11 R13 R20 R22 = R1210_30R_5%_0.5W_200PPM: Resistor - 5%; Part Description: Thick Film Chip Resistor; Manufacturer: VISHAY; Manufacturer Part Number: CRCW121030R0JNEA; Power: 0.5W; TC: ±200ppm/°C; PressFit: No; Part Number: R1210_30R_5%_0.5W_200ppm; Component Kind: Standard; Component Type: Standard; Pin Count: 2; Value: 30R; Status: None; Tolerance: ±5%; Case: 1210; Mounted: Yes; Sense: No; Socket: No; SMD: Yes; HelpURL: \\cern.ch\dfs\Applications\Altium\Datasheets\R1210_VISHAY_CRCW1210.pdf; Author: CERN DEM JMW; CreateDate: 06.08.2014; LatestRevisionDate: 06.08.2014; ComponentHeight: 0.6mm
R6 R7 R9 R14-R16 R21 R29 = R0402_22R_1%_0.0625W_100PPM: Resistor - 1%; Part Description: General Purpose Thick Film Chip Resistor; Manufacturer: GENERIC; Manufacturer1 Part Number: 232270672209L; TC: ±100ppm/°C; PressFit: No; Part Number: R0402_22R_1%_0.0625W_100PPM; Component Kind: Standard; Component Type: Standard; Pin Count: 2; Value: 22; Status: Not Recommended; Power: 0.0625W; Tolerance: ±1%; Manufacturer Part Number: R0402_22R_1%_0.0625W_100PPM; Case: 0402; Mounted: Yes; Sense: No; Socket: No; SMD: Yes; Manufacturer1 Example: YAGEO PHYCOMP; Manufacturer1 ComponentHeight: 0.4mm; HelpURL: \\cern.ch\dfs\Applications\Altium\Datasheets\R0402_Phycomp_RC0402.pdf; Author: CERN DEM JLC; CreateDate: 03.12.2007; LatestRevisionDate: 17.10.2012
R12 R19 = R0402_NO-VALUE: Resistor; Part Description: Reserved Footprint For a 0402 (1005) Chip Resistor; PressFit: No; Mounted: No; Part Number: R0402_NO-VALUE; Component Kind: Standard; Component Type: Standard; Pin Count: 2; Value: Undefined; Status: None; Manufacturer: Undefined; Manufacturer Part Number: R0402_NO-VALUE; Case: 0402; Sense: No; Socket: No; SMD: Yes; Manufacturer1 Example: Undefined; Manufacturer1 Part Number: Undefined; Manufacturer1 ComponentHeight: Undefined; HelpURL: Undefined; Author: CERN DEM JLC; CreateDate: 03.12.2007; LatestRevisionDate: 13.03.2008
R17 R23 R198 R201 R204 R207 R211 R221 R224 R227 R230 R234 = R0402_100R_1%_0.1W_100PPM: Resistor - 1%; Part Description: General Purpose Thick Film Chip Resistor; Manufacturer: GENERIC; Manufacturer Part Number: R0402_100R_1%_0.1W_100PPM_50V; Manufacturer1 Part Number: ERJ2RKF1000X; Power: 0.1W; TC: ±100ppm/°C; Voltage: 50V; Part Number: R0402_100R_1%_0.1W_100PPM; Component Kind: Standard; Component Type: Standard; Pin Count: 2; Value: 100; Status: Not recommended; Tolerance: ±1%; Case: 0402; Mounted: Yes; Sense: No; Socket: No; SMD: Yes; Manufacturer1 Example: PANASONIC; Manufacturer1 ComponentHeight: 0.4mm; HelpURL: \\cern.ch\dfs\Applications\Altium\Datasheets\R0402_PANASONIC_ERJ2RK.pdf; Author: CERN DEM JLC; CreateDate: 12.12.2013; LatestRevisionDate: 03.03.2015
R24 R26-R28 R32-R35 R44 R46 R196 R197 R200 R203 R206 R209 R210 R212 R219 R222 R226 R229 R233 R235 R236 = R0402_10K_1%_0.0625W_100PPM: Resistor - 1%; Part Description: General Purpose Thick Film Chip Resistor; Manufacturer: GENERIC; Manufacturer1 Part Number: 232270671003L; TC: ±100ppm/°C; Part Number: R0402_10K_1%_0.0625W_100PPM; Component Kind: Standard; Component Type: Standard; Pin Count: 2; Value: 10k; Status: Not recommended; Power: 0.0625W; Tolerance: ±1%; Manufacturer Part Number: R0402_10K_1%_0.0625W_100PPM; Case: 0402; Mounted: Yes; Sense: No; Socket: No; SMD: Yes; Manufacturer1 Example: YAGEO PHYCOMP; Manufacturer1 ComponentHeight: 0.4mm; HelpURL: \\cern.ch\dfs\Applications\Altium\Datasheets\R0402_Phycomp_RC0402.pdf; Author: CERN DEM JLC; CreateDate: 03.12.2007; LatestRevisionDate: 17.10.2012
R30 R31 = R0603_0R_JUMPER: Resistor; Part Description: 1A (0.05R Max DC Resistance) Zero Ohm Jumper; Manufacturer: GENERIC; Manufacturer1 Part Number: NRC06Z0; PressFit: No; Part Number: R0603_0R_JUMPER; Component Kind: Standard; Component Type: Standard; Pin Count: 2; Value: 0; Status: Preferred; Manufacturer Part Number: R0603_0R_JUMPER; Case: 0603; Mounted: Yes; Sense: No; Socket: No; SMD: Yes; Manufacturer1 Example: NIC COMPONENT; Manufacturer1 ComponentHeight: 0.55mm; HelpURL: \\cern.ch\dfs\Applications\Altium\Datasheets\R0603_NIC_NRC.pdf; Author: CERN DEM JLC; CreateDate: 03.12.2007; LatestRevisionDate: 13.03.2008
R36 R37 R40 R41 = R0402_0R_JUMPER: Resistor; Part Description: 1A (0.05R Max DC Resistance) Zero Ohm Jumper; Manufacturer: GENERIC; Manufacturer1 Part Number: 232270591001L; PressFit: No; Part Number: R0402_0R_JUMPER; Component Kind: Standard; Component Type: Standard; Pin Count: 2; Value: 0; Status: Not Recommended; Manufacturer Part Number: R0402_0R_JUMPER; Case: 0402; Mounted: Yes; Sense: No; Socket: No; SMD: Yes; Manufacturer1 Example: YAGEO PHYCOMP; Manufacturer1 ComponentHeight: 0.4mm; HelpURL: \\cern.ch\dfs\Applications\Altium\Datasheets\R0402_Phycomp_RC0402.pdf; Author: CERN DEM JLC; CreateDate: 03.12.2007; LatestRevisionDate: 17.10.2012
R38 R42 R194 R195 R213-R217 R220 R238-R241 = R0402_510R_1%_0.0625W_100PPM: Resistor - 1%; Part Description: General Purpose Thick Film Chip Resistor; Manufacturer: GENERIC; Manufacturer1 Part Number: 232270675101L; TC: ±100ppm/°C; Part Number: R0402_510R_1%_0.0625W_100PPM; Component Kind: Standard; Component Type: Standard; Pin Count: 2; Value: 510; Status: Not recommended; Power: 0.0625W; Tolerance: ±1%; Manufacturer Part Number: R0402_510R_1%_0.0625W_100PPM; Case: 0402; Mounted: Yes; Sense: No; Socket: No; SMD: Yes; Manufacturer1 Example: YAGEO PHYCOMP; Manufacturer1 ComponentHeight: 0.4mm; HelpURL: \\cern.ch\dfs\Applications\Altium\Datasheets\R0402_Phycomp_RC0402.pdf; Author: CERN DEM JLC; CreateDate: 03.12.2007; LatestRevisionDate: 17.10.2012
R45 = R0402_31K6_0.1%_0.063W_25PPM_YAGEO_RT: Resistor - 0.1%; Part Description: Thin Film Chip Resistor; Manufacturer: YAGEO; Manufacturer Part Number: RT0402BRD0731K6L; Power: 0.063W; TC: ±25ppm/°C; Voltage: 50V; PressFit: No; Part Number: R0402_31K6_0.1%_0.063W_25PPM_YAGEO_RT; Component Kind: Standard; Component Type: Standard; Pin Count: 2; Value: 31k6; Status: Not Recommended; Case: 0402; Mounted: Yes; Sense: No; Socket: No; SMD: Yes; ComponentHeight: 0.35mm; HelpURL: \\cern.ch\dfs\Applications\Altium\Datasheets\R0402_YAGEO_RT.pdf; Author: CERN DEM BC; CreateDate: 30.07.2020; LatestRevisionDate: 30.07.2020
R199 R202 R205 R208 R223 R225 R228 R232 = R1210_49R9_1%_0.5W_100PPM_VISHAY_CRCW: Resistor - 1%; Part Description: Thick Film Chip Resistor; Manufacturer: VISHAY DRALORIC; Manufacturer Part Number: CRCW121049R9FKTA; Power: 0.5W; TC: ±100ppm/°C; Part Number: R1210_49R9_1%_0.5W_100PPM_VISHAY_CRCW; Component Kind: Standard; Component Type: Standard; Pin Count: 2; Value: 49R9; Status: None; Tolerance: ±1%; Case: 1210; Mounted: Yes; Sense: No; Socket: No; SMD: Yes; ComponentHeight: 0.6mm; HelpURL: \\cern.ch\dfs\Applications\Altium\Datasheets\R1210_VISHAY_CRCW1210.pdf; Author: CERN DEM JMW; CreateDate: 06.08.2014; LatestRevisionDate: 06.08.2014
SW2 SW3 = SW_OMRON_A6S-4102-H: 4 Ways SPST DIP Switch; Part Description: 4 Ways SPST DIP Switch, White Flat Actuator with Seal Tape, Contact Rating 25mA 24VDC; Manufacturer: OMRON; PressFit: No; Part Number: SW_OMRON_A6S-4102-H; Component Kind: Standard; Component Type: Standard; Pin Count: 8; PackageDescription: Pitch 2.54mm, Body 11.3x6.4mm, 4 Ways SPST Surface-Mounting DIP Switch, OMRON A6S-H; Family: Switch; Mounted: Yes; Socket: No; SMD: Yes; Sense: No; Status: None; Manufacturer Part Number: A6S-4102-H; ComponentHeight: 3.8mm; HelpURL: \\cern.ch\dfs\Applications\Altium\Datasheets\SW_OMRON_A6S-4102-H.pdf; Author: CERN DEM JMW; CreateDate: 25.09.2008; LatestRevisionDate: 25.09.2008
SW9 = SW_OMRON_A6S-2102-H: 2 Ways SPST DIP Switch; Part Description: 2 Ways SPST DIP Switch, White Flat Actuator with Seal Tape, Contact Rating 25mA 24VDC; Manufacturer: OMRON; PressFit: No; Part Number: SW_OMRON_A6S-2102-H; Component Kind: Standard; Component Type: Standard; Pin Count: 4; PackageDescription: Pitch 2.54mm, Body 6.2x6.4mm, 2 Ways SPST Surface-Mounting DIP Switch, OMRON A6S-H; Family: Switch; Mounted: Yes; Socket: No; SMD: Yes; Sense: No; Status: None; Manufacturer Part Number: A6S-2102-H; ComponentHeight: 3.8mm; HelpURL: \\cern.ch\dfs\Applications\Altium\Datasheets\SW_OMRON_A6S-2102-H.pdf; Author: CERN DEM JMW; CreateDate: 25.09.2008; LatestRevisionDate: 25.09.2008
T1-T4 T10-T17 T27 T29 = BSS138LT1G: N-CHANNEL MOSFET WITH DIODE; Part Description: 50V 200mA N-Channel Enhancement Mode Field-Effect Transistor; Manufacturer: ON SEMICONDUCTOR; PressFit: No; Bonding: No; Part Number: BSS138LT1G; Component Kind: Standard; Component Type: Standard; Device: BSS138LT1G; PackageDescription: SOT23 3-Leads, Pitch 0.95mm - Body 1.4x3mm, IPC Medium Density; Manufacturer Part Number: BSS138LT1G; Pin Count: 3; Case: SOT23-3; Mounted: Yes; Socket: No; SMD: Yes; Sense: No; ComponentHeight: 1.11mm; HelpURL: \\cern.ch\dfs\Applications\Altium\Datasheets\BSS138LT1G.pdf; Author: CERN DEM JLC; CreateDate: 23.03.2009; LatestRevisionDate: 23.03.2009